# EasyEDA Pro project Example_FPC Stinffener Design.eprj

# Schematic Schematic1
Create Date: 2023-07-21; Page Name: P1; Project Name: 示例工程_FPC补强设计; Schematic Name: Schematic1; Update Date: 2023-07-21; Company: 嘉立创EDA; Page Size: A3; Version: V1.0
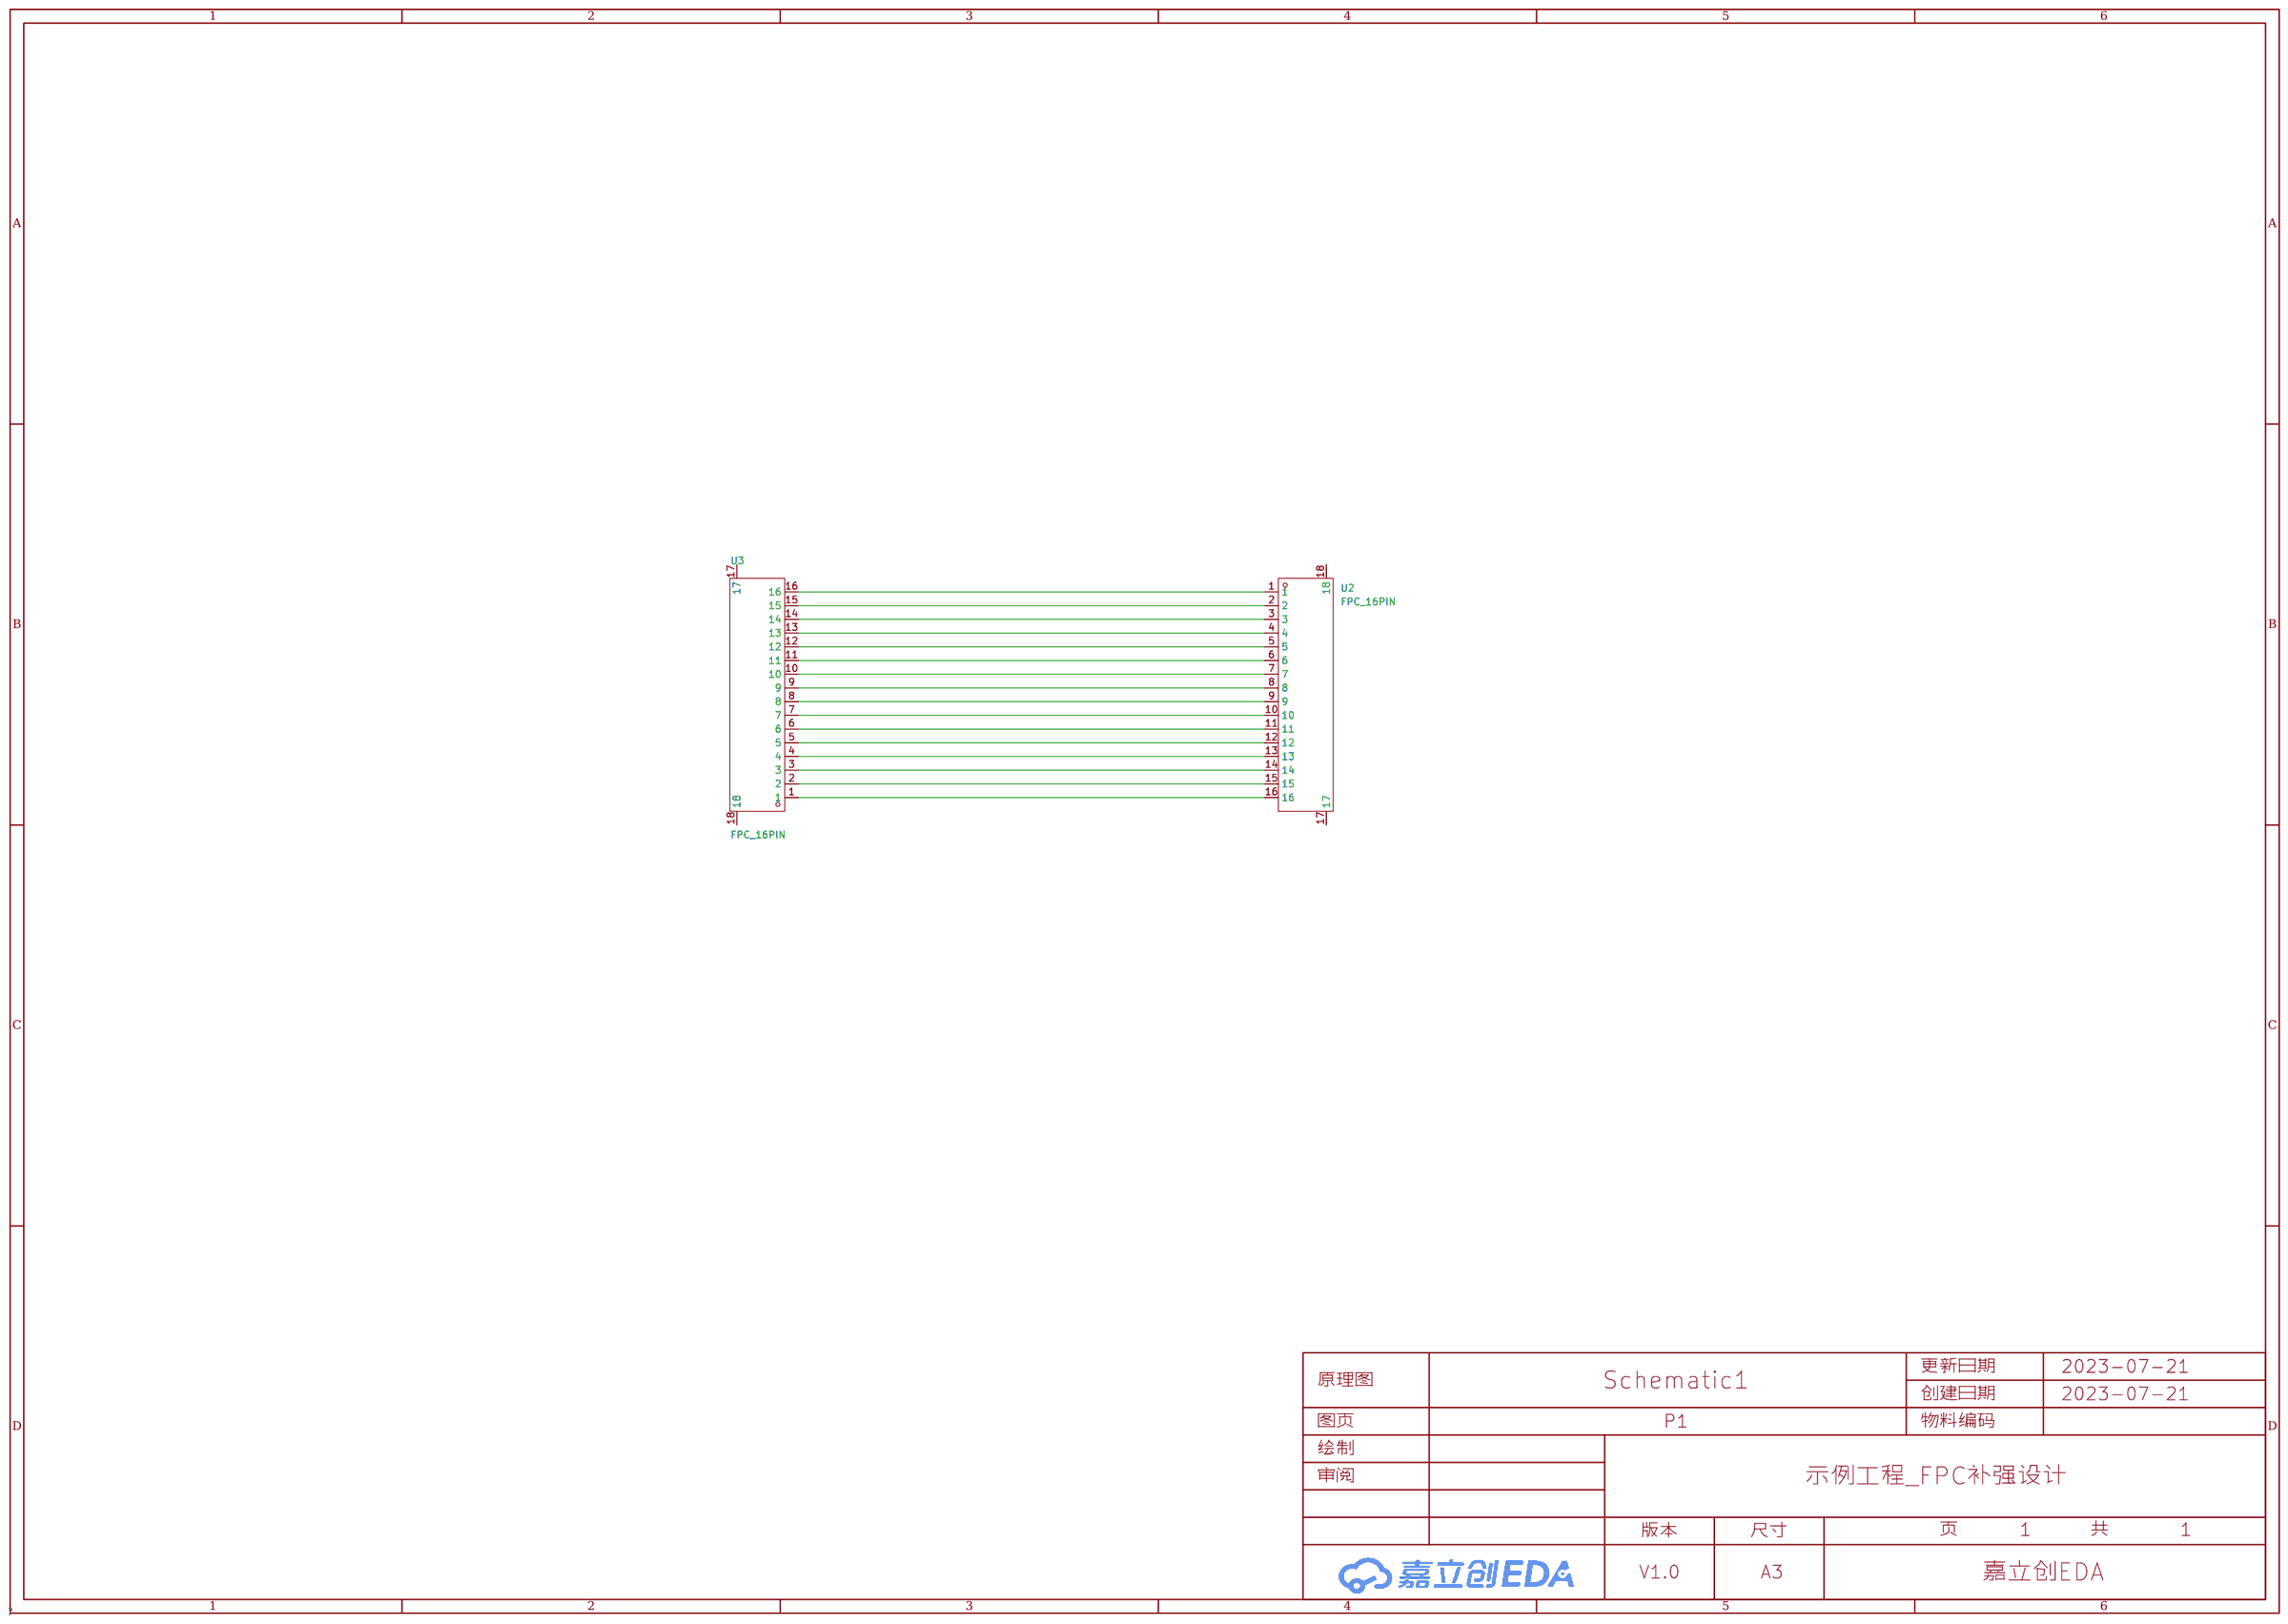
[diagram p0: schematic sheet]

## Parts
U2  FPC_16PIN  [FPC-SMD_16P-P0.50_C9900010530]
U3  FPC_16PIN  [FPC-SMD_16P-P0.50_C9900010530]

## Library data of the parts
U2 U3 = FPC_16PIN: Supplier Part: C9900010530; Supplier Footprint: FPC-16; JLCPCB Part Class: 扩展库; Datasheet: https://atta.szlcsc.comnull; Supplier: LCSC

## Nets
$U2_1: U2.1 U3.16
$U2_2: U2.2 U3.15
$U2_3: U2.3 U3.14
$U2_4: U2.4 U3.13
$U2_5: U2.5 U3.12
$U2_6: U2.6 U3.11
$U2_7: U2.7 U3.10
$U2_8: U2.8 U3.9
$U2_9: U2.9 U3.8
$U2_10: U2.10 U3.7
$U2_11: U2.11 U3.6
$U2_12: U2.12 U3.5
$U2_13: U2.13 U3.4
$U2_14: U2.14 U3.3
$U2_15: U2.15 U3.2
$U2_16: U2.16 U3.1

Not connected (* = marked no-connect by the designer): U2 17 18; U3 17 18

# Board PCB1
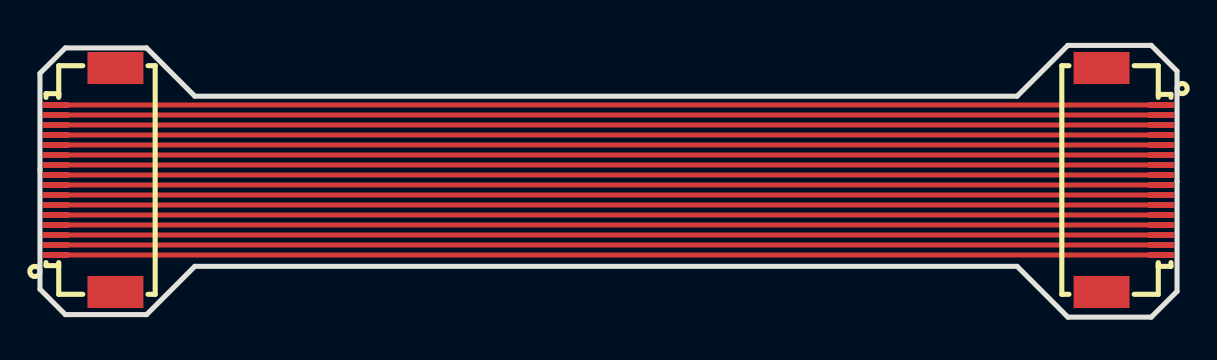
[diagram p1: board, top side]
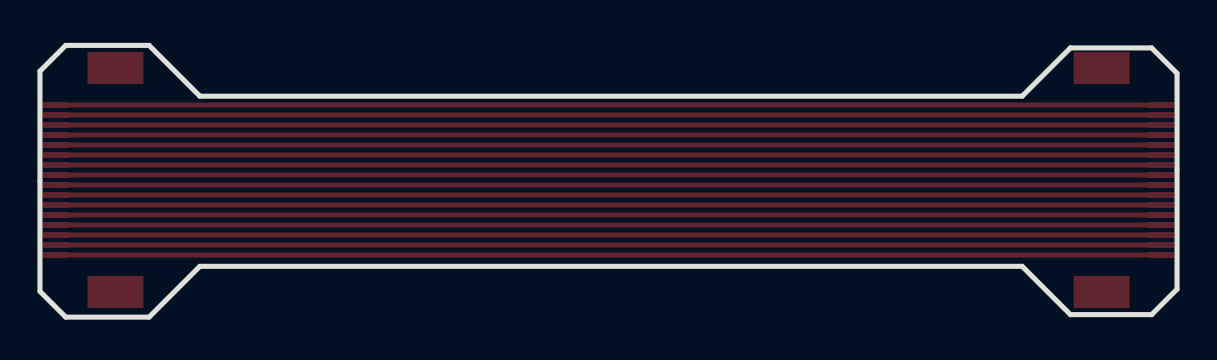
[diagram p2: board, bottom side, seen from below]

Outline 56.9 x 13.59 mm; copper layers: Top Layer, Bottom Layer. Coordinates in mm from the lower left corner of the outline.
Outline path: 0,12.19 1.27,13.46 5.33,13.46 7.75,11.05 48.89,11.05 51.43,13.59 55.61,13.59 56.9,12.3 56.9,1.29 55.61,0 51.43,0 48.89,2.54 7.75,2.54 5.33,0.13 1.27,0.13 0,1.4 0,12.19
Stack: Top Layer 0.012mm / Dielectric1 0.025mm FR4 er 4.5 / Bottom Layer 0.012mm

## Design rules (mm)
template: JLCPCB Capability(Two Layers Board)
spacing copperThickness1oz (default): track to track 0.102, other pairs 0.152 to 0.3
spacing copperThickness2oz: track to track 0.203, other pairs 0.152 to 0.3
track width copperThickness1oz (default): min 0.127, default 0.254, max 2.54
track width copperThickness2oz: min 0.203, default 0.254, max 2.54
differential pair differentialPair (default): width min 0.127, default 0.254, max 2.54; gap min 0.152, default 0.152
via viaSize (default): diameter min 0.5, default 0.61, max 10; hole min 0.3, default 0.305, max 6.3

## Placement (name value [footprint] x y rotation side)
U2  FPC_16PIN  [FPC-SMD_16P-P0.50_C9900010530]  54.61 6.86 270 top
U3  FPC_16PIN  [FPC-SMD_16P-P0.50_C9900010530]  2.29 6.86 90 top

## Footprints (pads in the part's own frame, mm; a bottom-side part is the same pattern mirrored in y, then rotated)
FPC-SMD_16P-P0.50_C9900010530
  rect 0.3x1.3 smd: 1(-3.75,1.49) 2(-3.25,1.49) 3(-2.75,1.49) 4(-2.25,1.49) 5(-1.75,1.49) 6(-1.25,1.49) 7(-0.75,1.49) 8(-0.25,1.49) 9(0.249,1.49) 10(0.75,1.49) 11(1.25,1.49) 12(1.75,1.49) 13(2.25,1.49) 14(2.75,1.49) 15(3.25,1.49) 16(3.75,1.49)
  rect 1.6x2.8 smd: 17(5.6,-1.49) 18(-5.6,-1.49)

## Nets
As in the schematic.

Pads without a net: U2 17 18; U3 17 18

## Routing (per net, layer and track width the routed paths; a pad name or vN(x,y) marks a point on that pad's centre or on a via; arc(x,y) is an arc through that point)
$U2_1: length 55.3
  Top Layer w0.254: U3.16 U2.1
$U2_2: length 55.3
  Top Layer w0.254: U3.15 U2.2
$U2_3: length 55.3
  Top Layer w0.254: U3.14 U2.3
$U2_4: length 55.3
  Top Layer w0.254: U3.13 U2.4
$U2_5: length 55.3
  Top Layer w0.254: U3.12 U2.5
$U2_6: length 55.3
  Top Layer w0.254: U3.11 U2.6
$U2_7: length 55.3
  Top Layer w0.254: U3.10 56.1,7.61
$U2_8: length 55.3
  Top Layer w0.254: U3.9 U2.8
$U2_9: length 55.3
  Top Layer w0.254: U3.8 56.1,6.61
$U2_10: length 55.3
  Top Layer w0.254: U3.7 U2.10
$U2_11: length 55.3
  Top Layer w0.254: U3.6 56.1,5.61
$U2_12: length 55.3
  Top Layer w0.254: U3.5 U2.12
$U2_13: length 55.3
  Top Layer w0.254: U3.4 U2.13
$U2_14: length 55.3
  Top Layer w0.254: U3.3 U2.14
$U2_15: length 55.3
  Top Layer w0.254: U3.2 U2.15
$U2_16: length 55.3
  Top Layer w0.254: U3.1 U2.16

## Text on the board
Document Layer: Click the stiffener object, you can set the material and thickness | If you want to cut out the board, you can place a Solt Region | When generate the Gerber, the stiffener layer will be generated by each layer and material | When you order at JLCPCB, it will use the Gerber stiffener parameters to order | If the top side is the metal touch side, then you should place the stinffener at bottom side | After placed, that will create the top or bottom stiffener layer automatically | In the top menu: Place - FPC Stinffener, place reinforcement elements
